# EAGLE design board (EAGLE 7.5.0)
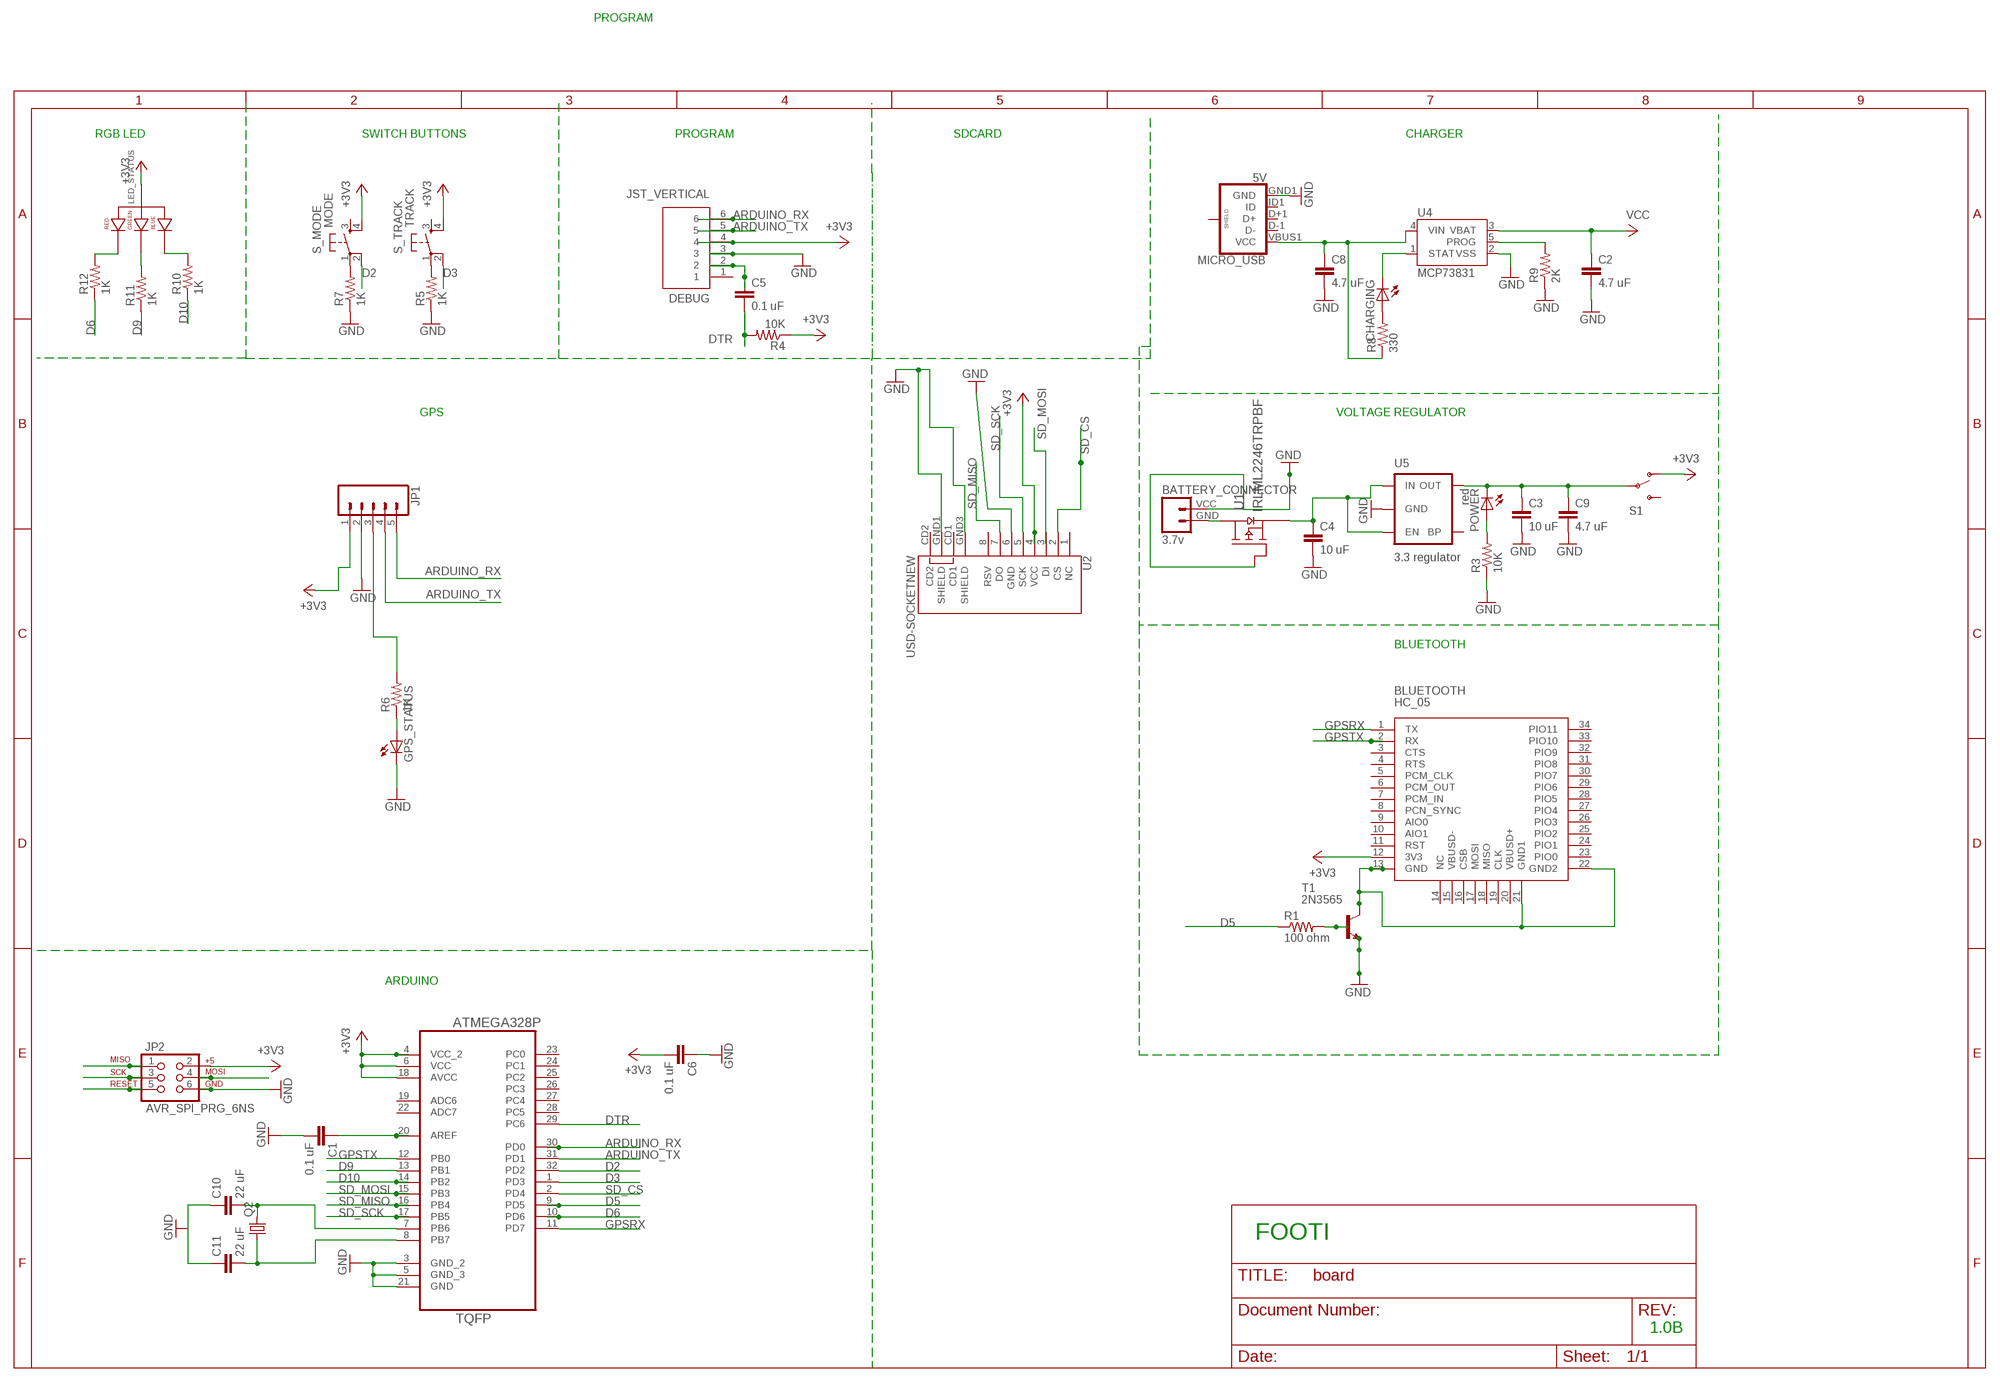
[diagram p0: schematic, sheet 1]

## Parts
BATTERY_CONNECTOR  3.7v  M024UCON-15767  [JST-2-SMD-VERT]
BLUETOOTH  HC_05  [BLUETOOTH_SMD]
C1  0.1 uF  CAP1206  [1206]
C2  4.7 uF  CAP1206  [1206]
C3  10 uF  CAP1206  [1206]
C4  10 uF  CAP1206  [1206]
C5  0.1 uF  CAP1206  [1206]
C6  0.1 uF  CAP1206  [1206]
C8  4.7 uF  CAP1206  [1206]
C9  4.7 uF  CAP1206  [1206]
C10  22 uF  CAP1206  [1206]
C11  22 uF  CAP1206  [1206]
CHARGING  LED_E  [LED_1206]
DEBUG  JST_VERTICAL  [JST-6-SMD-VERT-1.0MM]
GPS_STATUS  LED_E  [LED_1206]
JP1  M05PTH  [1X05]
JP2  AVR_SPI_PRG_6NS  [2X3-NS]
LED_STATUS  LED_RGB_PLCC_AVAGO_MTB0  [LED_RGB_PLCC_AVAGO_MTB0]
MICRO_USB  5V  USB_MICROB_PLUGCONN-11752  [USB-B-MICRO-SMD_V03]
POWER  red  LED_E  [LED_1206]
Q2  CRYSTALCTS406  [CTS406]
R1  100 ohm  RESISTOR1206  [1206]
R3  10K  RESISTOR1206  [1206]
R4  10K  RESISTOR1206  [1206]
R5  1K  RESISTOR1206  [1206]
R6  1K  RESISTOR1206  [1206]
R7  1K  RESISTOR1206  [1206]
R8  330  RESISTOR1206  [1206]
R9  2K  RESISTOR1206  [1206]
R10  1K  RESISTOR1206  [1206]
R11  1K  RESISTOR1206  [1206]
R12  1K  RESISTOR1206  [1206]
S1  SWITCH-SPDT-SMD-A  [SWITCH-SPST-SMD-A]
S_MODE  MODE  DTSM-6  [DTSM-6]
S_TRACK  TRACK  DTSM-6  [DTSM-6]
T1  2N3565  [TO92]
U1  IRLML2246TRPBF  [SOT95P237X112-3N_O]
U2  USD-SOCKETNEW  [MICRO-SD-SOCKET-PP]
U4  MCP73831  [SOT23-5]
U5  3.3 regulator  MIC52053.3V  [SOT23-5]
U6  ATMEGA328P-AU  [QFP80P900X900X120-32N]

## Nets
+3V3: BLUETOOTH.12(3V3) C6.2 DEBUG.4 JP1.1 JP2.2 LED_STATUS.1(ANODE) R4.1 S1.1(O) S_MODE.4 S_TRACK.4 U2.4(VCC) U6.4(VCC_2) U6.6(VCC) U6.18(AVCC)
ARDUINO_RX: DEBUG.6 JP1.5 U6.30(PD0)
ARDUINO_TX: DEBUG.5 JP1.4 U6.31(PD1)
D2: S_MODE.2 U6.32(PD2)
D3: S_TRACK.2 U6.1(PD3)
D5: R1.1 U6.9(PD5)
D6: R12.1 U6.10(PD6)
D9: R11.1 U6.13(PB1)
D10: R10.1 U6.14(PB2)
DTR: C5.2 JP2.5 R4.2 U6.29(PC6)
GND [ground]: BATTERY_CONNECTOR.VCC C1.2 C2.2 C3.2 C4.2 C6.1 C8.2 C9.2 C10.1 C11.1 DEBUG.3 GPS_STATUS.C JP1.2 JP2.6 MICRO_USB.GND1(GND) R3.1 R5.1 R7.1 R9.1 T1.3(E) U1.1(G) U2.6(GND) U2.GND1(SHIELD) U2.GND3(SHIELD) U4.2(VSS) U5.2(GND) U6.3(GND_2) U6.5(GND_3) U6.21(GND)
GPSRX: BLUETOOTH.1(TX) U6.11(PD7)
GPSTX: BLUETOOTH.2(RX) U6.12(PB0)
N$1: C3.1 C9.1 POWER.C S1.2(P) U5.5(OUT)
N$2: C8.1 MICRO_USB.VBUS1(VCC) R8.1 U4.4(VIN)
N$4: JP1.3 R6.2
N$6: GPS_STATUS.A R6.1
N$8: CHARGING.A R8.2
N$9: R7.2 S_MODE.1
N$10: R5.2 S_TRACK.1
N$11: CHARGING.C U4.1(STAT)
N$13: C5.1 DEBUG.2
N$14: BATTERY_CONNECTOR.GND U1.3(D)
N$15: R9.2 U4.5(PROG)
N$16: POWER.A R3.2
N$17: LED_STATUS.3(GREEN_CATHODE) R11.2
N$18: LED_STATUS.4(RED_CATHODE) R12.2
N$19: R1.2 T1.2(B)
N$20: BLUETOOTH.13(GND) BLUETOOTH.21(GND1) BLUETOOTH.22(GND2) T1.1(C)
N$21: LED_STATUS.2(BLUE_CATHODE) R10.2
N$22: C1.1 U6.20(AREF)
N$27: C11.2 Q2.1 U6.8(PB7)
N$29: C10.2 Q2.3 U6.7(PB6)
SD_CS: U2.2(CS) U6.2(PD4)
SD_MISO: JP2.1 U2.7(DO) U6.16(PB4)
SD_MOSI: JP2.4 U2.3(DI) U6.15(PB3)
SD_SCK: JP2.3 U2.5(SCK) U6.17(PB5)
VCC: C2.1 C4.1 U1.2(S) U4.3(VBAT) U5.1(IN) U5.3(EN)
Unconnected: BLUETOOTH.3(CTS) BLUETOOTH.4(RTS) BLUETOOTH.5(PCM_CLK) BLUETOOTH.6(PCM_OUT) BLUETOOTH.7(PCM_IN) BLUETOOTH.8(PCN_SYNC) BLUETOOTH.9(AIO0) BLUETOOTH.10(AIO1) BLUETOOTH.11(RST) BLUETOOTH.14(NC) BLUETOOTH.15(VBUSD-) BLUETOOTH.16(CSB) BLUETOOTH.17(MOSI) BLUETOOTH.18(MISO) BLUETOOTH.19(CLK) BLUETOOTH.20(VBUSD+) BLUETOOTH.23(PIO0) BLUETOOTH.24(PIO1) BLUETOOTH.25(PIO2) BLUETOOTH.26(PIO3) BLUETOOTH.27(PIO4) BLUETOOTH.28(PIO5) BLUETOOTH.29(PIO6) BLUETOOTH.30(PIO7) BLUETOOTH.31(PIO8) BLUETOOTH.32(PIO9) BLUETOOTH.33(PIO10) BLUETOOTH.34(PIO11) DEBUG.1 MICRO_USB.D+1(D+) MICRO_USB.D-1(D-) MICRO_USB.ID1(ID) MICRO_USB.SHIELD1(SHIELD) MICRO_USB.SHIELD2(SHIELD) MICRO_USB.SHIELD3(SHIELD) S1.3(S) S_MODE.3 S_TRACK.3 U2.1(NC) U2.8(RSV) U2.CD1 U2.CD2 U5.4(BP) U6.19(ADC6) U6.22(ADC7) U6.23(PC0) U6.24(PC1) U6.25(PC2) U6.26(PC3) U6.27(PC4) U6.28(PC5)

## Notes on the sheet
- PROGRAM
- RGB LED | SWITCH BUTTONS | PROGRAM | SDCARD | CHARGER
- GPS | VOLTAGE REGULATOR
- BLUETOOTH
- ARDUINO
- FOOTI
- 1.0B

## Library data of the parts
BATTERY_CONNECTOR = SparkFun-Connectors:M02: Standard 2-pin 0.1" header. Use with - straight break away headers ( PRT-00116) - right angle break away headers (PRT-00553) - swiss pins (PRT-00743) - machine pins (PRT-00117) - female headers (PRT-00115) Molex polarized connector foot print use with: PRT-08233 with associated crimp pins and housings. 2.54_SCREWTERM for use with PRT-10571. 3.5mm Screw Terminal footprints for PRT-08084 5mm Screw Terminal footprints for use with PRT-08432; OC_FARNELL: unknown
BLUETOOTH = SerialPortBluetooth:HC_05; OC_FARNELL: unknown
C1 C5 C6 = SparkFun-Capacitors:CAP: Capacitor Standard 0603 ceramic capacitor, and 0.1" leaded capacitor.; MF: KEMET; MPN: C0402C104K4RACTU; OC_FARNELL: 1288252
C2 C8 C9 = SparkFun-Capacitors:CAP: Capacitor Standard 0603 ceramic capacitor, and 0.1" leaded capacitor.; MF: WALSIN; MPN: 1206B475K500CT; OC_FARNELL: 2497114
C3 C4 = SparkFun-Capacitors:CAP: Capacitor Standard 0603 ceramic capacitor, and 0.1" leaded capacitor.; MF: WALSIN; MPN: 1206B106K160CT; OC_FARNELL: 2497081
C10 C11 = SparkFun-Capacitors:CAP: Capacitor Standard 0603 ceramic capacitor, and 0.1" leaded capacitor.; MF: MULTICOMP; MPN: MC1206F226Z100CT; OC_FARNELL: 1759435
CHARGING GPS_STATUS = eagle-ltspice:LED_E: LED Source: http://www.osram.convergy.de Source: www.luxeon.com Source: www.kingbright.com; MF: KINGBRIGHT; MPN: KPTL-3216ZGC; OC_FARNELL: 2217899; SPICEMODEL: NONE; SPICEPREFIX: D; SPICETYPE: diode
DEBUG = SparkFun-Connectors:JST_VERTICAL; OC_FARNELL: unknown; PROD_ID: CONN-08249
JP1 = SparkFun-Connectors:M05: Header 5 Standard 5-pin 0.1" header. Use with straight break away headers (SKU : PRT-00116), right angle break away headers (PRT-00553), swiss pins (PRT-00743), machine pins (PRT-00117), and female headers (PRT-00115). Molex polarized connector foot print use with SKU : PRT-08230 with associated crimp pins and housings.
JP2 = SparkFun-Connectors:AVR_SPI_PRG_6: AVR ISP 6 Pin This is the reduced ISP connector for AVR programming. Common on Arduino. This footprint will take up less PCB space and can be used with a 10-pin to 6-pin adapter such as SKU: BOB-08508 **Special note about "TEST_POINT" package. The stop mask is on the top side, so if you want your programming test points to be on the bottom of your board, make sure to place this package on the bottom side of the board. This also ensure that the orientation to program from the bottom side will be correct.; OC_FARNELL: unknown
LED_STATUS = pretender:LED_RGB_PLCC_AVAGO_MTB0; MF: AVAGO TECHNOLOGIES; MPN: ASMB-MTB0-0A3A2; OC_FARNELL: 2401105
MICRO_USB = SparkFun-Connectors:USB_MICROB_PLUG: USB Micro-B connectors Some male, some female. Watch your step!; OC_FARNELL: unknown; PROD_ID: CONN-11752
POWER = eagle-ltspice:LED_E: LED Source: http://www.osram.convergy.de Source: www.luxeon.com Source: www.kingbright.com; MF: KINGBRIGHT; MPN: KPTL-3216SURCK-01; OC_FARNELL: 2217903; SPICEMODEL: NONE; SPICEPREFIX: D; SPICETYPE: diode
Q2 = crystal:CRYSTAL: CRYSTAL; MF: ABRACON; MPN: ABMM2-8.000MHZ-E2-T; OC_FARNELL: 1611803; OC_NEWARK: unknown
R1 = SparkFun-Passives:RESISTOR: Resistor Basic schematic elements and footprints for 0603, 1206, and PTH resistors.; MF: YAGEO (PHYCOMP); MPN: RC1206FR-07100RL; OC_FARNELL: 9240888
R3 R4 = SparkFun-Passives:RESISTOR: Resistor Basic schematic elements and footprints for 0603, 1206, and PTH resistors.; MF: VISHAY; MPN: CRCW120610K0FKEA; OC_FARNELL: 1469970
R5-R7 R10-R12 = SparkFun-Passives:RESISTOR: Resistor Basic schematic elements and footprints for 0603, 1206, and PTH resistors.; MF: VISHAY; MPN: CRCW12061K00FKTA; OC_FARNELL: 1653075
R8 = SparkFun-Passives:RESISTOR: Resistor Basic schematic elements and footprints for 0603, 1206, and PTH resistors.; MF: WELWYN; MPN: WCR1206-330RFI; OC_FARNELL: 1100177
R9 = SparkFun-Passives:RESISTOR: Resistor Basic schematic elements and footprints for 0603, 1206, and PTH resistors.; MF: VISHAY; MPN: CRCW12062K00FKEA; OC_FARNELL: 1469985
S1 = SparkFun-Electromechanical:SWITCH-SPDT: SPDT Switch Simple slide switch, Spark Fun Electronics SKU : COM-00102 DPDT SMT slide switch, AYZ0202, SWCH-08179
S_MODE S_TRACK = switch-tact:DTSM-6; MF: TE CONNECTIVITY; MPN: FSM1LP; OC_FARNELL: 1813691
T1 = transistor:2N3565: NPN TRANSISTOR; MF: ON SEMICONDUCTOR; MPN: 2N5089G; OC_FARNELL: 1126530
U1 = pretender:IRLML2246TRPBF: HEXFET Power MOSFET; MF: INFINEON; MPN: IRLML2246TRPBF; OC_FARNELL: 1888166; OC_NEWARK: 40T7450; PACKAGE: SOT-3; SUPPLIER: International Rectifier
U2 = SparkFun-Connectors:USD-SOCKET: microSD Socket Push-push type uSD socket. Schematic element and footprint production proven. Spark Fun Electronics SKU : PRT-00127. tDoc lines correctly indicate media card edge positions when inserting (unlocked, locked, depressed). NOTE: CD1 and CD2 are connected internally; MF: MULTICOMP; MPN: 460DE08C3; OC_FARNELL: 1686452; PROD_ID: CONN-07820
U4 = SparkFun-PowerIC:MCP73831: Miniature single cell, fully integrated Li-Ion, Li-polymer charge management controller http://ww1.microchip.com/downloads/en/DeviceDoc/20001984g.pdf IC-09995; MF: MICROCHIP; MPN: MCP73831T-2ACI/OT; OC_FARNELL: 1332158; PROD_ID: IC-09995
U5 = SparkFun-PowerIC:MIC5205: MIC5205 150mA vreg 3.3V - VREG-00822 5V - VREG-00823; MF: MICREL SEMICONDUCTOR; MPN: MIC5205-3.3YM5 TR; OC_FARNELL: 1663083; PROD_ID: VREG-00822
U6 = Ava:ATMEGA328P-AU; DESCRIPTION: 8-bit Microcontroller with In-System Programmable Flash; MF: ATMEL; MPN: ATMEGA328P-AU; OC_FARNELL: 1715486; OC_NEWARK: 14R4631; PACKAGE: TQFP-32; SUPPLIER: Atmel

## Net classes
1 ground: width 0.508 mm

## Board
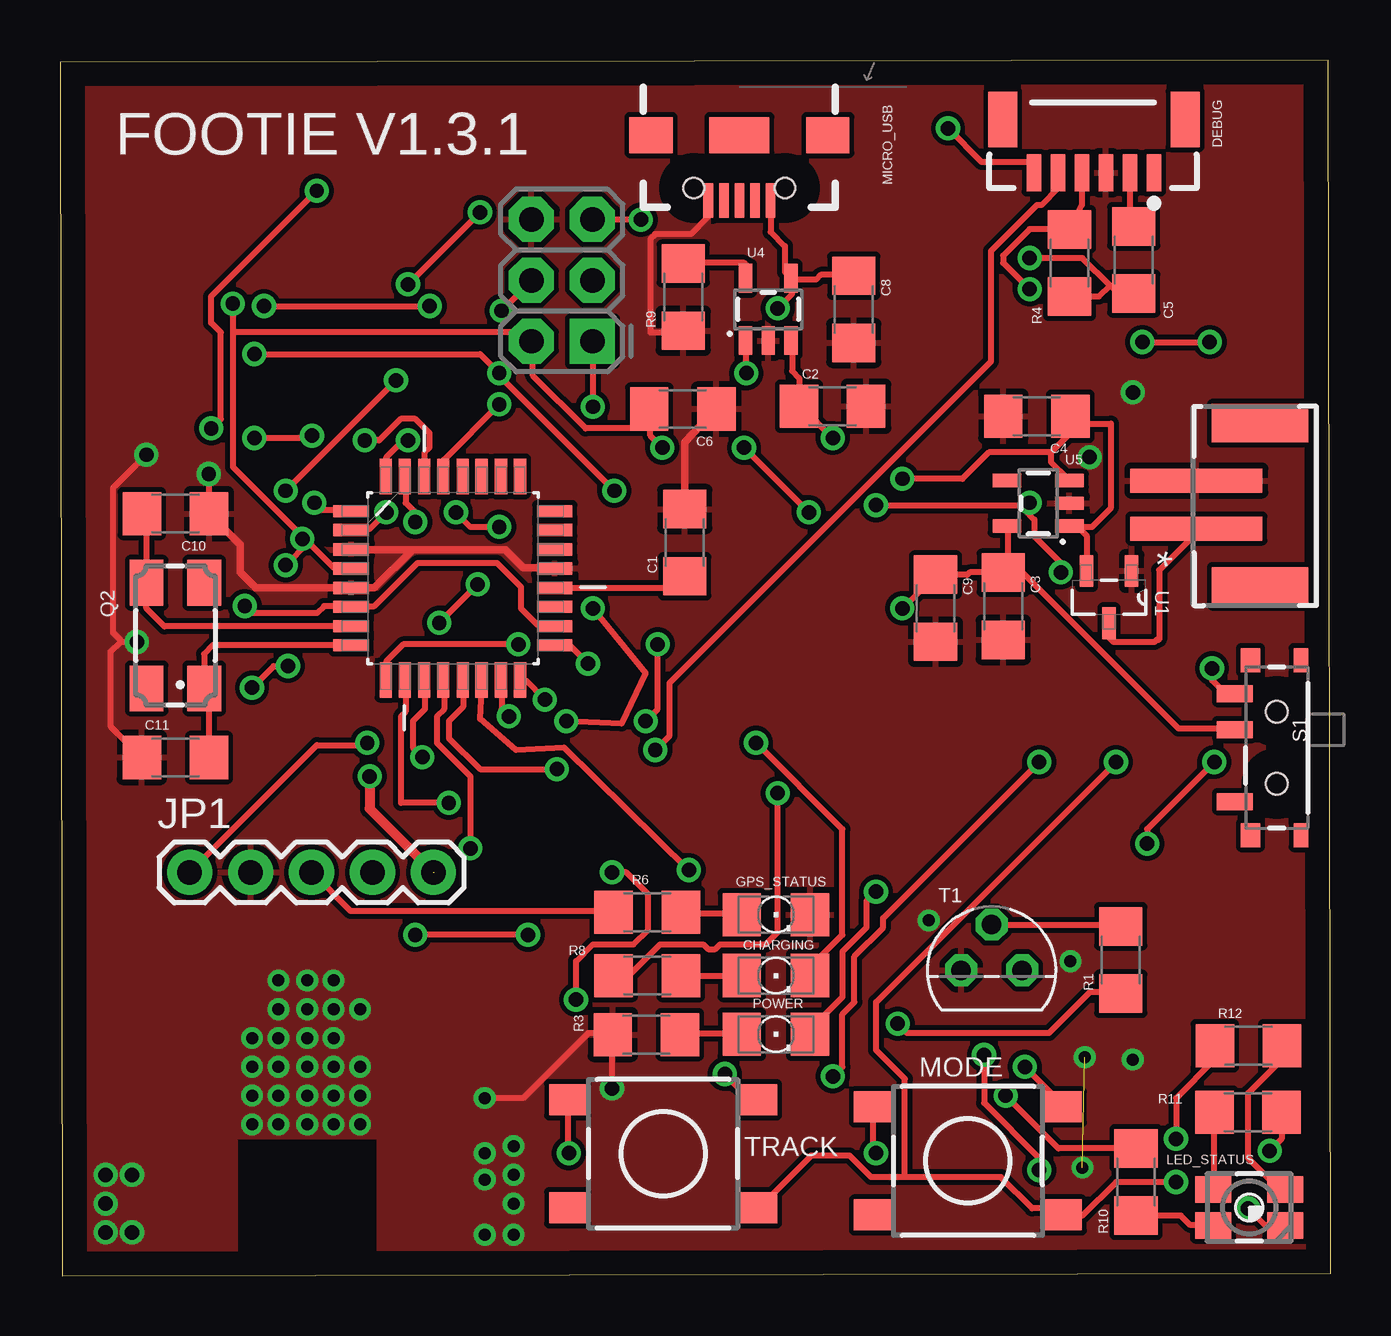
[diagram p1: board, top side]
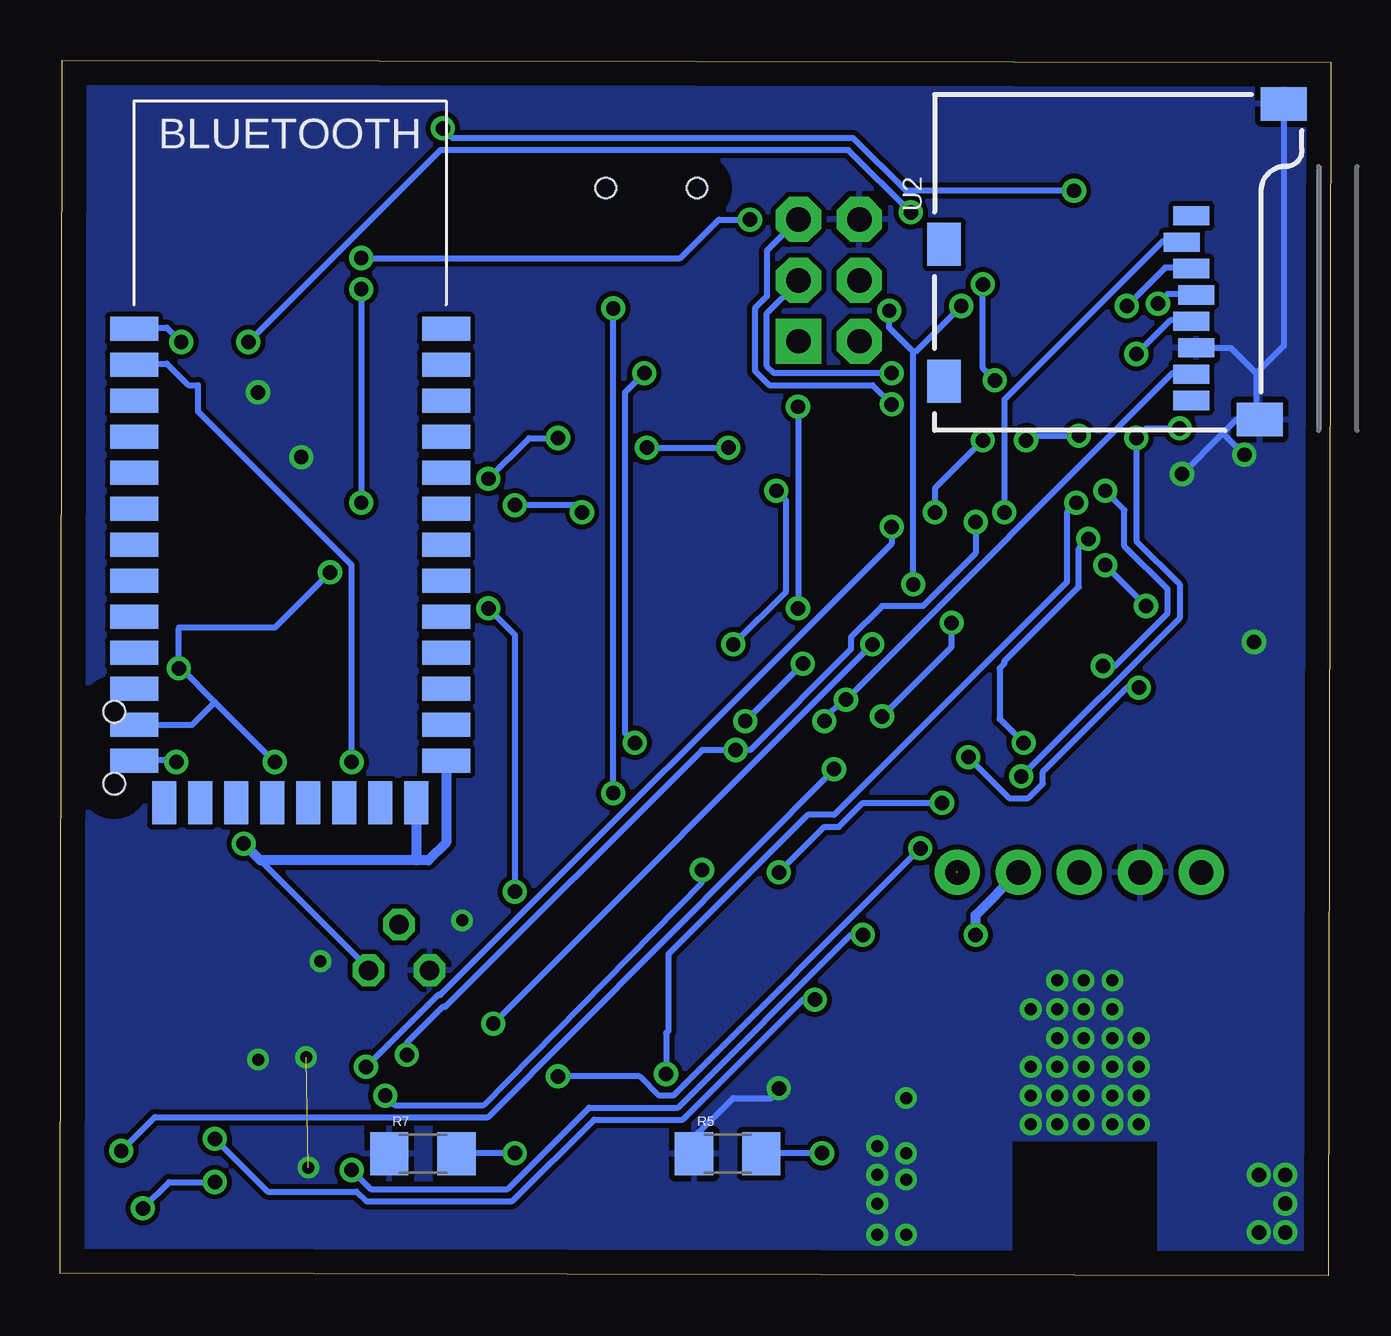
[diagram p2: board, bottom side, seen from below]

Size 52.95 x 50.65 mm. Coordinates in mm from the lower left corner, seen from the top.
Outline: 0.1,0 52.95,0.1 52.85,50.65 0,50.55 0.1,0
Copper layers (1*16): Top 0.035mm / dielectric 1.5mm / Bottom 0.035mm
Design rules "default": minimum track width 10mil, minimum drill 24mil, track to track 8mil, track to pad 8mil, pad to pad 8mil, via to via 8mil, smd to smd 8mil, copper to edge 40mil, drill to drill 8mil, minimum pad ring 10mil, minimum via ring 8mil, stop-mask expansion 4mil, vias tented up to drill 0mil, thermal gap 10mil

### Footprints (pad centres in the part's own frame; a part is rotated, then mirrored left to right if it is on the bottom)
JST-2-SMD-VERT = smd 1 x 5.5: GND 1,-2; VCC -1,-2 | smd 1.6 x 4.016: P$1 -3.4,0.651; P$2 3.4,0.651
BLUETOOTH_SMD = smd 2 x 1: 1 0,0; 2 0,-1.5; 3 0,-3; 4 0,-4.5; 5 0,-6; 6 0,-7.5; 7 0,-9; 8 0,-10.5; 9 0,-12; 10 0,-13.5; 11 0,-15; 12 0,-16.5; 13 0,-18; 22 13,-18; 23 13,-16.5; 24 13,-15; 25 13,-13.5; 26 13,-12; 27 13,-10.5; 28 13,-9; 29 13,-7.5; 30 13,-6; 31 13,-4.5; 32 13,-3; 33 13,-1.5; 34 13,0 | smd 1 x 1.8: 14 1.25,-19.75; 15 2.75,-19.75; 16 4.25,-19.75; 17 5.75,-19.75; 18 7.25,-19.75; 19 8.75,-19.75; 20 10.25,-19.75; 21 11.75,-19.75
1206 = smd 1.6 x 1.8: 1 -1.4,0; 2 1.4,0
LED_1206 = smd 1.6 x 1.803: A -1.422,0; C 1.422,0
JST-6-SMD-VERT-1.0MM = smd 0.6 x 1.55: 1 -2.54,1.27; 2 -1.54,1.27; 3 -0.54,1.27; 4 0.46,1.27; 5 1.46,1.27; 6 2.46,1.27 | smd 1.2 x 2.308: P$1 -3.84,-0.955; P$2 3.76,-0.955
1X05 = drill 1.016 pad 1.88: 1 0,0; 2 2.54,0; 3 5.08,0; 4 7.62,0; 5 10.16,0
2X3-NS = drill 1.016 pad 1.88 square: 1 -2.54,-1.27 | drill 1.016 pad 1.88 octagon: 2 -2.54,1.27; 3 0,-1.27; 4 0,1.27; 5 2.54,-1.27; 6 2.54,1.27
LED_RGB_PLCC_AVAGO_MTB0 = smd 1.1 x 1.5: 1 0.75,1.5; 2 0.75,-1.5; 3 -0.75,-1.5; 4 -0.75,1.5
USB-B-MICRO-SMD_V03 = smd 1.45 x 0.4: D+1 2.725,0; D-1 2.725,0.65; GND1 2.725,-1.3; ID1 2.725,-0.65; VBUS1 2.725,1.3 | smd 1.5 x 1.8: SHIELD1 0,3.685; SHIELD2 0,-3.685 | smd 1.5 x 2.5: SHIELD3 0,0 | hole 0.85: 2.2,1.9; 2.2,-1.9
CTS406 = smd 1.9 x 1.4: 1 -2.2,-1.2; 2 2.2,-1.2; 3 2.2,1.2; 4 -2.2,1.2
SWITCH-SPST-SMD-A = smd 0.7 x 1.5: 1 -2.25,-1.75; 2 -0.75,-1.75; 3 2.25,-1.75 | smd 1 x 0.6: GND1 -3.65,1; GND3 3.65,1 | smd 1 x 0.8: GND2 -3.65,-1.1; GND4 3.65,-1.1 | hole 0.9: -1.5,0; 1.5,0
DTSM-6 = smd 1.55 x 1.3: 1 -3.975,2.25; 2 3.975,2.25; 3 -3.975,-2.25; 4 3.975,-2.25
TO92 = drill 0.813 octagon: 1 1.27,0; 2 0,1.905; 3 -1.27,0
SOT95P237X112-3N_O = smd 1.321 x 0.559: 1 -1.092,0.94; 2 -1.092,-0.94; 3 1.092,0
MICRO-SD-SOCKET-PP = smd 0.8 x 1.5: 1 -8.94,10.7; 2 -7.84,10.3; 3 -6.74,10.7; 4 -5.64,10.9; 5 -4.54,10.7; 6 -3.44,10.9; 7 -2.34,10.7; 8 -1.24,10.7 | smd 1.8 x 1.4: CD1 -2.05,0.4; CD2 -7.75,0.4 | smd 1.4 x 1.9: GND1 -13.6,14.55; GND3 -0.45,13.55
SOT23-5 = smd 0.55 x 1.2: 1 -0.95,-1.3; 2 0,-1.3; 3 0.95,-1.3; 4 0.95,1.3; 5 -0.95,1.3
QFP80P900X900X120-32N = smd 1.473 x 0.508: 1 -4.242,2.794; 2 -4.242,2.007; 3 -4.242,1.194; 4 -4.242,0.406; 5 -4.242,-0.406; 6 -4.242,-1.194; 7 -4.242,-2.007; 8 -4.242,-2.794; 17 4.242,-2.794; 18 4.242,-2.007; 19 4.242,-1.194; 20 4.242,-0.406; 21 4.242,0.406; 22 4.242,1.194; 23 4.242,2.007; 24 4.242,2.794 | smd 0.508 x 1.473: 9 -2.794,-4.242; 10 -2.007,-4.242; 11 -1.194,-4.242; 12 -0.406,-4.242; 13 0.406,-4.242; 14 1.194,-4.242; 15 2.007,-4.242; 16 2.794,-4.242; 25 2.794,4.242; 26 2.007,4.242; 27 1.194,4.242; 28 0.406,4.242; 29 -0.406,4.242; 30 -1.194,4.242; 31 -2.007,4.242; 32 -2.794,4.242

### Placement (x,y rotation side)
BATTERY_CONNECTOR  49.35,32.12 270 top
BLUETOOTH  49.86,39.45 0 bottom
C1  26.03,30.54 90 top
C2  32.19,36.22 0 top
C3  39.3,27.89 270 top
C4  40.7,35.81 180 top
C5  44.74,42.32 270 top
C6  25.95,36.11 180 top
C8  33.07,40.26 270 top
C9  36.48,27.81 270 top
C10  4.81,31.75 180 top
C11  4.81,21.59 0 top
CHARGING  29.83,12.5 0 top
DEBUG  43.04,47.22 180 top
GPS_STATUS  29.83,15.04 0 top
JP1  5.4,16.8 0 top
JP2  20.91,41.47 90 top
LED_STATUS  49.55,2.84 270 top
MICRO_USB  28.31,47.52 270 top
POWER  29.83,10.06 0 top
Q2  4.81,26.67 90 top
R1  44.2,13.15 90 top
R3  24.43,10.04 0 top
R4  42.06,42.19 270 top
R5  25.13,5.08 0 bottom
R6  24.47,15.14 180 top
R7  37.83,5.08 0 bottom
R8  24.47,12.5 0 top
R9  25.97,40.77 90 top
R10  44.83,3.9 270 top
R11  49.5,6.81 180 top
R12  49.52,9.58 0 top
S1  50.7,22 270 top
S_MODE  37.83,4.78 0 top
S_TRACK  25.13,5.08 0 top
T1  38.82,12.72 0 top
U1  43.71,28.27 270 top
U2  16.51,35.22 270 bottom
U4  29.51,40.26 0 top
U5  40.76,32.18 90 top
U6  16.37,29.06 0 top

### Tracks (layer width: path | path; a pad name or v marks a point on that pad's centre or on a via)
+3V3  (via drill 0.6)
  Top 0.254: S_TRACK.4 29.2,2.9 31.3,5 32.9,5 33.8,4.1 35.2,4.1 | 35.2,4.1 39.2,4.1 40.5,2.8 41.8,2.8 S_MODE.4 41.9,2.5 42.6,2.5 44,3.9 v46.5,3.9 | U6.18 20.5,27.1 19.9,27.1 19.2,27.8 19.2,28.7 18.2,29.7 14.9,29.7 13.1,27.9 12.2,27.9 U6.6 12.1,27.9 11,27.9 10.7,27.6 8,27.6 v7.7,27.9 | 10.15,30.75 7.2,33.7 7.2,39.3 | 10.15,30.75 10.35,30.55 | 10.35,30.55 11.4,29.5 12.1,29.5 U6.4 | v7.2,40.5 7.2,39.3 | v9.4,29.6 10.35,30.55 | 7.2,39.3 19.3,39.3 19.6,39 JP2.2 19.7,38.9 19.7,37.5 21.9,35.3 24.5,35.3 C6.2 24.6,36.1 24.6,35 v25.1,34.5 | v10.1,30.7 10.15,30.75 | DEBUG.4 42.58,44.61 R4.1 42,43.6 40.4,43.6 39.3,42.5 39.3,42.2 v40.4,41.1 | v31.2,31.8 v28.5,34.5 | v49.5,2.8 50.2,2.1 51,2.1 LED_STATUS.1 | JP1.1 10.7,22.1 12.7,22.1 v12.8,22.2 | v48,25.3 48,24.8 48.5,24.3 48.9,24.3 S1.1 | v41.7,29.3 41.7,29.7 40.6,30.8 40.6,31.5 40.15,31.95 | 40.15,31.95 40,32.1 v34,32.1 | v40.4,32.2 40.15,31.95 | v44,21.4 34,11.4 34,9.4 35.2,8.2 35.2,4.1
  Bottom 0.254: v7.2,40.5 6.8,40.9 5.7,40.9 U2.4 | v7.7,27.9 v9.4,29.6 | v10.1,30.7 10.5,30.3 10.5,28.7 13.6,25.6 13.6,25.5 13.8,25.3 13.8,23.2 v12.8,22.2 | v28.5,34.5 v25.1,34.5 | v46.5,3.9 48.4,3.9 v49.5,2.8 | v41.7,29.3 44,27 48,27 v48,25.3 47.9,25.3 46.5,23.9 | v34,32.1 31.5,32.1 v31.2,31.8 | v40.4,41.1 v40.4,32.2 | v44,21.4 46.5,23.9 | BLUETOOTH.12 47.45,22.95 46.5,23.9
ARDUINO_RX  (via drill 0.6)  (1 unrouted)
  Top 0.254: v37,47.8 38.4,46.4 40.5,46.4 40.6,46.3 40.6,46 DEBUG.6 | v10.7,45.2 6.3,40.8 6.3,39.7 6.7,39.3 6.7,35.7 v6.3,35.3 | v8.1,34.9 10.4,34.9 v10.5,35 | v12.7,34.8 13.3,34.8 14.2,35.7 14.8,35.7 15.4,35.1 15.4,34.5 15.2,34.3 15.2,33.4 U6.30 | 15.6,16.8 15.5,16.9
  Top 0.406: v12.9,20.8 12.9,19.46 JP1.5
  Bottom 0.254: v37,47.8 36.6,47.4 19.9,47.4 17.7,45.2 v10.7,45.2 | v6.3,35.3 7.7,35.3 v8.1,34.9 8.1,30.6 6.3,28.8 6.3,27.4 v12.9,20.8 | v10.5,35 12.5,35 v12.7,34.8
ARDUINO_TX  (via drill 0.6)
  Top 0.254: DEBUG.5 41.6,45.9 41.6,45.3 40.9,44.6 40.7,44.6 38.8,42.7 38.8,38.1 25.4,24.7 25.4,22.5 v24.8,21.9 | v14.8,31.4 14.8,31.8 14.4,32.2 14.4,33.3 U6.31 | v19.5,14.2 v14.8,14.2 | v40.8,4.4 40.8,4.9 38.5,7.2 v38.5,9.2
  Bottom 0.254: v14.8,31.4 14.8,30.1 17,27.9 18.7,27.9 20,26.6 20,26.1 24.2,21.9 v24.8,21.9 26.2,21.9 36.9,11.2 37,11.2 38.5,9.7 v38.5,9.2 | v19.5,14.2 20,14.2 27.2,7 30.9,7 34.3,3.6 40,3.6 v40.8,4.4
  Bottom 0.406: v14.8,14.2 14.8,15.02 JP1.4
D2  (via drill 0.6)
  Top 0.254: v40.2,8.7 41.8,7.1 S_MODE.2 | v18.3,31.2 17.1,31.2 v16.5,31.8 | v14.5,34.8 14.3,34.8 13.6,34.1 13.6,33.4 U6.32
  Bottom 0.254: v40.2,8.7 37.2,11.7 37.1,11.7 18.3,30.5 v18.3,31.2 | v16.5,31.8 16.5,32.8 v14.5,34.8
D3  (via drill 0.6)
  Top 0.254: 29.1,7.4 S_TRACK.2 29,7.3 28.8,7.3 v27.7,8.4 | v10.6,32.2 10.9,31.9 12.1,31.9 U6.1
  Bottom 0.254: v27.7,8.4 27.7,10.1 27.6,10.2 27.6,13.4 21.8,19.2 20.7,19.2 11,28.9 11,31.8 v10.6,32.2
D5  (via drill 0.6)
  Top 0.254: v19.1,26.3 14.3,26.3 13.6,25.6 13.6,24.9 U6.9 | v34.9,10.5 35.3,10.1 41.2,10.1 42.9,11.8 44.2,11.8 R1.1
  Bottom 0.254: v34.9,10.5 v19.1,26.3
D6  (via drill 0.6)
  Top 0.254: U6.10 14.4,24.8 14.4,23.5 14.2,23.3 14.2,19.7 v16.2,19.7 | v23,16.8 23.6,16.8 24.5,15.9 24.5,14.4 23.9,13.8 22.2,13.8 21.5,13.1 v21.5,11.5 | v46.5,5.7 46.5,7.4 48.1,9 48.1,9.5 R12.1
  Bottom 0.254: v16.2,19.7 19.5,19.7 20.5,18.7 21.1,18.7 v23,16.8 | v21.5,11.5 22,11.5 27,6.5 30.7,6.5 34.1,3.1 40.2,3.1 40.6,3.5 44.3,3.5 v46.5,5.7
D9  (via drill 0.6)
  Top 0.254: v50.4,5.2 50.9,5.7 R11.1 | U6.13 16.8,24.8 16.8,23.7 16.2,23.1 16.2,22.4 17.5,21.1 v20.7,21.1
  Bottom 0.254: v20.7,21.1 35.1,6.6 49,6.6 v50.4,5.2
D10  (via drill 0.6)
  Top 0.254: v26.2,16.9 21,22 19,21.9 17.5,23.2 17.6,24.8 U6.14 | v39.4,7.5 41.6,5.3 R10.1
  Bottom 0.254: v26.2,16.9 26.2,16.4 35.3,7.1 39,7.1 v39.4,7.5
DTR  (via drill 0.6)
  Top 0.254: v18.3,36.3 16,34 16,33.4 U6.29 | v24.2,44 22.2,44 JP2.5 | v40.4,42.4 42.6,42.4 43.75,41.25 | 43.75,41.25 44.1,40.9 44.7,40.9 C5.2 | 43.75,41.25 43.3,40.8 42.1,40.8 R4.2
  Bottom 0.254: v18.3,36.3 19.1,37.1 23.4,37.1 24,37.7 24,40.3 23.5,40.8 23.5,42.7 22.2,44 JP2.5 | v24.2,44 25.5,44 27.1,42.4 v40.4,42.4
GND  (via drill 0.5, 0.6)  (1 unrouted)
  Top 0.254: v17.7,7.4 19.3,7.4 22,10.1 22.9,10.1 23,10.2 23.1,10.1 R3.1 23,10 v23,7.8 | v3.2,26.4 2.5,26.4 | 2.5,26.4 2.1,26 2.1,22.9 C11.1 | v6.2,33.4 6.2,31.9 C10.1 | v3.6,34.2 2.2,32.8 2.2,26.8 2.5,26.5 2.5,26.4 | MICRO_USB.GND1 27.01,44.11 26.3,43.4 24.8,43.4 24.6,43.2 24.6,39.3 25.9,39.3 R9.1
  Top 0.305: C10.1 7.5,30.46 7.5,29.3 8.15,28.65 U6.5 13.1,28.65 14.7,30.25 | U6.3 14.7,30.25 | 14.7,30.25 18.55,30.25 19.3,29.5 20.58,29.5 U6.21 | C1.2 26.03,34.73 C6.1
  Bottom 0.254: R5.1 26.5,5.1 26.5,5.8 24.9,7.4 23.3,7.4 23.3,7.5 v23,7.8 | 4.5,35.1 3.9,35.7 3,35.7 U2.GND3 3.1,35.81 3.1,37.6 | 4.5,35.1 v6.2,33.4 | 4.5,35.1 v3.6,34.2 | U2.6 4.16,38.66 3.1,37.6 | U2.GND1 1.96,38.74 3.1,37.6
  other vias: 1.9,1.8 3,1.8 1.9,3 1.9,4.2 3,4.2 9.1,12.3 10.3,12.3 11.4,12.3 9.1,11.1 10.3,11.1 12.5,11.1 11.4,11.1 8,9.9 9.1,9.9 10.3,9.9 11.4,9.9 8,8.7 9.1,8.7 10.3,8.7 12.5,8.7 11.4,8.7 8,7.5 9.1,7.5 10.3,7.5 12.5,7.5 11.4,7.5 8,6.3 9.1,6.3 10.3,6.3 12.5,6.3 11.4,6.3 17.7,1.7 17.7,4 17.7,5.1 18.9,5.4 18.9,4.2 18.9,3 18.9,1.7 42.9,34.1 44.7,36.8 36.2,14.8 42.1,13.1 42.7,9.1 44.7,9 42.6,4.5
  pour Top: 0,50.5 0.2,0.2 7.3,0.2 7.3,5.6 7.1,5.8 13.3,5.8 13.3,0 53.1,0 52.8,50.3
  pour Bottom: 0,50.1 0.2,-0.1 7.1,0 7.1,5.7 13.4,5.7 13.4,0.1 53,0.1 52.8,50.2
GPSRX  (via drill 0.6)
  Top 0.254: v45.1,38.9 v47.9,38.9 | v14.5,41.3 v17.5,44.3 | v9.4,32.7 v14,37.3 | v9.5,25.4 8.9,25.4 v8,24.5 | v15.1,21.6 14.7,22 14.7,23.1 15.2,23.6 15.2,24.8 U6.11
  Bottom 0.254: v45.1,38.9 37.1,46.9 20.1,46.9 v17.5,44.3 | v14.5,41.3 14.5,37.8 v14,37.3 | v9.4,32.7 8.6,31.9 8.6,30.4 6.8,28.6 6.8,27.6 9,25.4 v9.5,25.4 | v8,24.5 8.5,24.5 12,21 12,20.5 12.6,19.9 13.4,19.9 v15.1,21.6 | v47.9,38.9 48.5,39.5 49.8,39.5 BLUETOOTH.1
GPSTX  (via drill 0.6)
  Top 0.254: v40.8,21.4 34.3,14.9 34.3,14.5 33.1,13.3 33.1,11.4 32.6,10.9 32.6,8.7 v32.2,8.3 | v17.1,17.8 17.1,20.8 15.7,22.2 15.7,23.3 16,23.6 16,24.8 U6.12
  Bottom 0.254: BLUETOOTH.2 49.8,38 48.5,38 47.6,37.1 47.2,37.1 47.2,36 40.8,29.6 v40.8,21.4 | v32.2,8.3 28.8,8.3 28,7.5 27.4,7.5 v17.1,17.8
N$1  (via drill 0.6)
  Top 0.254: 39.3,31.2 39.4,31.3 U5.5 39.5,31.1 39.5,29.3 39.4,29.3 C3.1 | S1.2 48.9,22.8 46.6,22.8 40.1,29.3 39.6,29.3 C3.1 | v34,16 33.6,15.6 33.6,14.5 32.6,13.5 32.6,11.6 31.3,10.3 31.3,10.1 POWER.C | v35.1,27.8 35.8,28.5 35.8,29.1 35.9,29.2 36.4,29.2 C9.1 36.6,29.2 37.8,29.2 37.9,29.3 39.2,29.3 C3.1
  Bottom 0.254: v34,16 34,26.7 v35.1,27.8
N$2  (via drill 0.6)
  Top 0.254: MICRO_USB.VBUS1 29.61,43.49 30.2,42.9 30.2,41.82 U4.4 | v29.9,40.3 30.5,40.9 30.5,41.5 U4.4 | v29.9,20.1 29.9,14.3 29.4,13.8 27.5,13.8 27.3,13.6 27,13.6 26.8,13.8 25,13.8 23.7,12.5 23.2,12.5 23.1,12.4 23,12.5 R8.1 | U4.4 30.6,41.5 31.5,41.5 31.7,41.7 33,41.7 C8.1
  Bottom 0.254: v29.9,20.1 v29.9,40.3
N$4
  Top 0.254: R6.2 23,15.2 12.1,15.2 10.5,16.8 JP1.3
N$6
  Top 0.254: GPS_STATUS.A 28.4,15.1 26,15.1 25.9,15 25.8,15.1 R6.1
N$8
  Top 0.254: CHARGING.A 26,12.5 25.9,12.6 25.8,12.5 R8.2
N$9  (via drill 0.6)
  Top 0.254: S_MODE.1 33.85,5.25 v34,5.1
  Bottom 0.254: v34,5.1 36.41,5.1 R7.2
N$10  (via drill 0.6)
  Top 0.254: S_TRACK.1 21.16,5.14 v21.2,5.1
  Bottom 0.254: v21.2,5.1 23.71,5.1 R5.2
N$11  (via drill 0.6)
  Top 0.254: v28.6,37.6 28.6,38.9 U4.1 | v29,22.2 32.6,18.6 32.6,14.2 31.7,13.3 31.4,13.3 31.3,13.2 31.3,12.5 CHARGING.C
  Bottom 0.254: v28.6,37.6 29.4,36.8 29.4,22.6 v29,22.2
N$13
  Top 0.254: DEBUG.2 44.58,43.88 C5.1
N$14
  Top 0.254: BATTERY_CONNECTOR.GND 47.4,31.2 47.5,31.1 45.8,29.4 45.8,26.5 45.7,26.5 45.6,26.4 43.9,26.4 43.7,26.6 43.7,27.1 U1.3
N$15
  Top 0.254: R9.2 26,42.2 28.5,42.2 28.6,42.1 28.6,41.6 U4.5
N$16
  Top 0.254: POWER.A 28.4,10.1 25.9,10.1 R3.2
N$17
  Top 0.254: R11.2 48.1,3.7 48.2,3.6 48.4,3.6 LED_STATUS.3
N$18
  Top 0.254: R12.2 50.9,9.5 50.9,9 49.5,7.6 49.5,4.9 50.8,3.6 51.4,3.6 LED_STATUS.4
N$19
  Top 0.254: T1.2 38.9,14.6 44.2,14.6 R1.2
N$20  (via drill 0.6)
  Top 0.254: v45.3,18 45.3,18.6 v48.1,21.4
  Bottom 0.254: v45.3,18 40.1,12.8 T1.1 | v48.1,21.4 48.4,21.4 48.5,21.5 49.8,21.5 BLUETOOTH.13
  Bottom 0.406: BLUETOOTH.22 36.86,18.04 37.6,17.3 38.1,17.3 | 38.1,17.3 44.6,17.3 v45.3,18 | BLUETOOTH.21 38.11,17.31 38.1,17.3
N$21
  Top 0.254: R10.2 46.7,2.5 47.1,2.1 48.4,2.1 LED_STATUS.2
N$22
  Top 0.254: U6.20 25.54,28.65 C1.1
N$27
  Top 0.254: C11.2 6.21,24.27 Q2.1 6,25.9 6.37,26.27 U6.8
N$29
  Top 0.254: C10.2 3.61,31.55 Q2.3 3.6,27.8 4.35,27.05 U6.7
SD_CS  (via drill 0.6)
  Top 0.254: v13.6,31.8 12.9,31.1 12.2,31.1 U6.2
  Bottom 0.254: v13.6,31.8 13.6,36.5 7,43.1 6.3,43.1 U2.2
SD_MISO  (via drill 0.6)
  Top 0.254: v20.2,24 19.4,24.8 19.2,24.8 U6.16 | v21.1,23.1 23.4,23 24.4,25.1 v22.2,27.8 | v22.2,36.2 22.2,38.9 JP2.1
  Bottom 0.254: U2.7 5.9,37.6 6.6,37.6 v20.2,24 20.3,24 21.1,23.2 v21.1,23.1 | v22.2,36.2 v22.2,27.8
SD_MOSI  (via drill 0.6)
  Top 0.254: v18.4,40.2 19.6,41.4 JP2.4 | v15.8,27.2 v17.4,28.8 | v18.7,23.3 18.4,23.6 18.4,24.8 U6.15 | v8.5,40.4 v15.4,40.4
  Bottom 0.254: v18.4,40.2 18.4,39.5 17.4,38.5 | v17.4,28.8 17.4,38.5 | v15.8,27.2 15.8,26.2 v18.7,23.3 | v15.4,40.4 17.3,38.5 17.4,38.5 | v8.5,40.4 6.9,42 5.9,42 U2.3
SD_SCK  (via drill 0.6)
  Top 0.254: v8.1,38.4 17.5,38.4 v18.3,37.6 18.3,37.5 v23.1,32.7 | v24.9,26.3 24.9,23.6 v24.4,23.1 | v22,25.5 21.2,26.3 20.7,26.3 U6.17
  Bottom 0.254: v18.3,37.6 23.2,37.6 23.5,37.9 23.5,40.1 22.2,41.4 JP2.3 | v8.1,38.4 6.7,39.8 5.9,39.8 U2.5 | v23.1,32.7 22.7,32.3 22.7,28.5 v24.9,26.3 | v22,25.5 v24.4,23.1
VCC  (via drill 0.6)
  Top 0.254: U4.3 30.5,38.9 30.5,37.7 30.8,37.4 30.8,36.3 C2.1 30.9,36.2 v32.2,34.9 | v35.1,33.2 37.6,33.2 38.7,34.3 41.3,34.3 | 41.3,34.3 42.1,35.1 C4.1 42.2,35.5 43.8,35.5 43.8,32 43,31.2 42.6,31.2 U5.1 | 41.3,34.3 41.3,33.9 42,33.2 U5.3 42.1,33.1 | 42.5,31.2 42.1,31.2 U5.1 | U5.1 42.5,31.1 42.8,30.8 42.8,29.4 U1.2
  Bottom 0.254: v32.2,34.9 33.4,34.9 v35.1,33.2

### Text on the board
tNames: FOOTIE V1.3.1